# EAGLE design Arduino_R3_Half_Template (EAGLE 7.2.0)
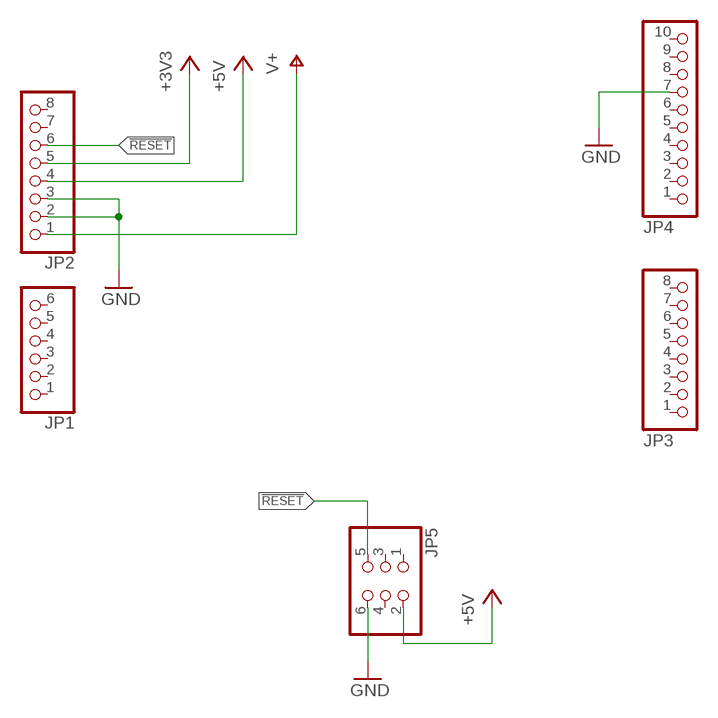
[diagram p0: schematic, sheet 1]

## Parts
JP1  PINHD-1X6  [1X06]
JP2  PINHD-1X8  [1X08]
JP3  PINHD-1X8  [1X08]
JP4  PINHD-1X10  [1X10]
JP5  PINHD-2X3  [2X03]

## Nets
!RESET: JP2.6 JP5.5
+3V3: JP2.5
+5V [usbvcc]: JP2.4 JP5.2
GND [ground]: JP2.2 JP2.3 JP4.7 JP5.6
V+ [power]: JP2.1
Unconnected: JP1.1 JP1.2 JP1.3 JP1.4 JP1.5 JP1.6 JP2.7 JP2.8 JP3.1 JP3.2 JP3.3 JP3.4 JP3.5 JP3.6 JP3.7 JP3.8 JP4.1 JP4.2 JP4.3 JP4.4 JP4.5 JP4.6 JP4.8 JP4.9 JP4.10 JP5.1 JP5.3 JP5.4

## Library data of the parts
JP1 = Arduino_R3_Half_Template:PINHD-1X6: PIN HEADER
JP2 JP3 = Arduino_R3_Half_Template:PINHD-1X8: PIN HEADER
JP4 = Arduino_R3_Half_Template:PINHD-1X10: PIN HEADER
JP5 = Arduino_R3_Half_Template:PINHD-2X3: PIN HEADER

## Net classes
0 default: width 0.254 mm, clearance 0.254 mm
1 power: width 0.61 mm, drill 0.61 mm, clearance 0.254 mm
2 ground: width 0.305 mm, drill 0.559 mm, clearance 0.254 mm
3 usbvcc: width 0.508 mm, drill 0.61 mm, clearance 0.254 mm
4 aref: width 0.406 mm, drill 0.61 mm, clearance 0.254 mm

## Board
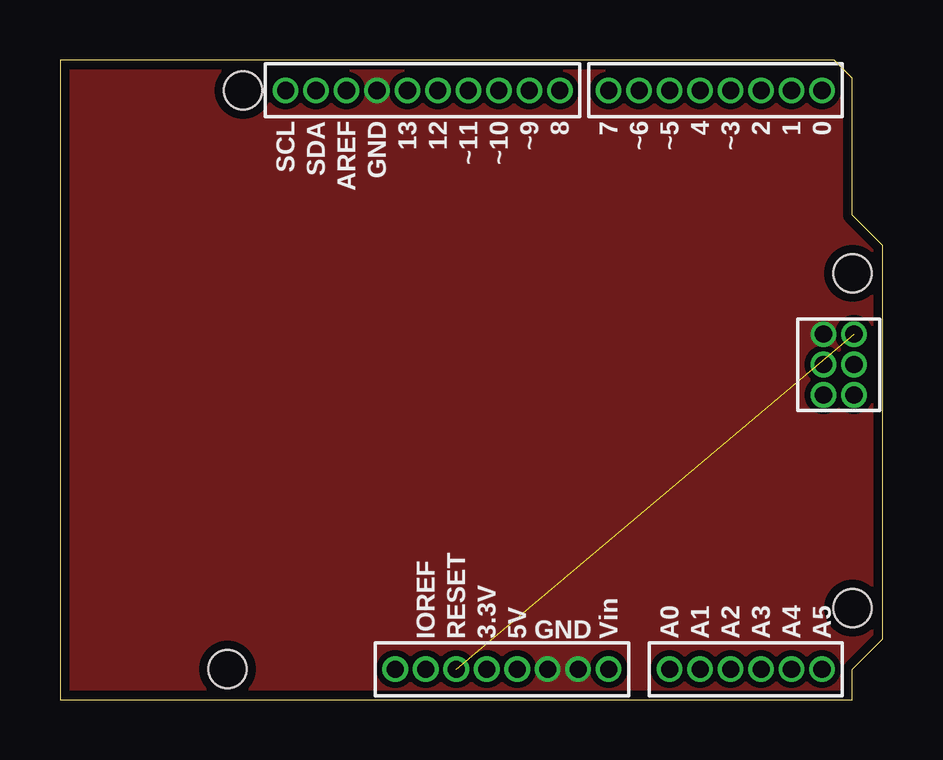
[diagram p1: board, top side]
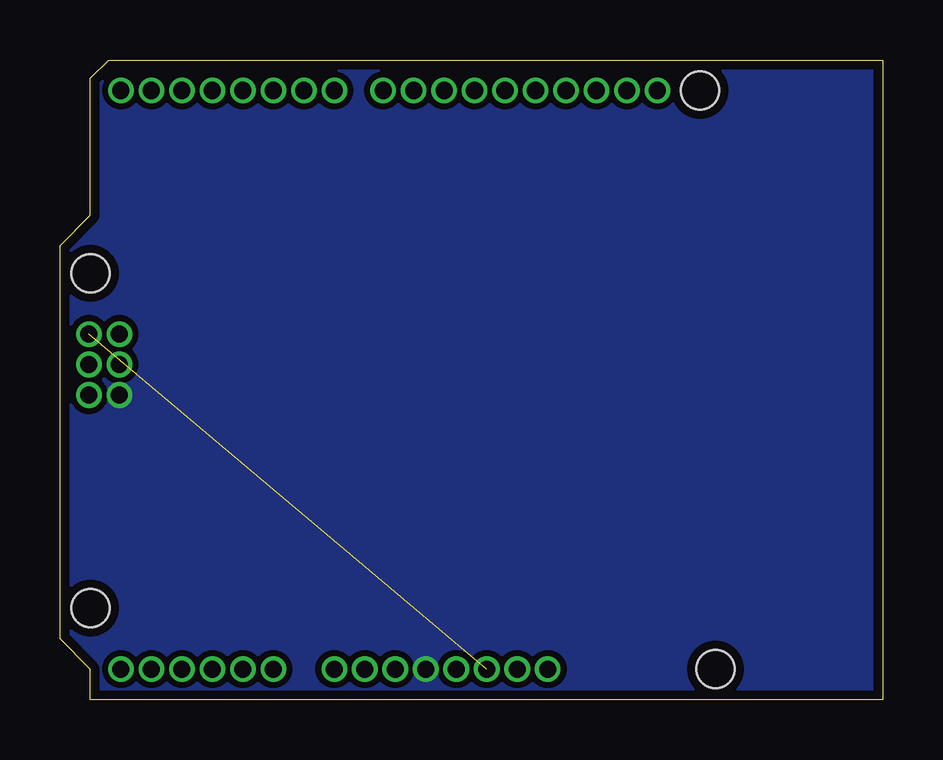
[diagram p2: board, bottom side, seen from below]

Size 34.29 x 26.67 mm. Coordinates in mm from the lower left corner, seen from the top.
Outline: 0,0 33.02,0 33.02,1.27 34.29,2.54 34.29,18.92 33.02,20.19 33.02,25.91 32.26,26.67 0,26.67 0,0
Copper layers (1*16): Top 0.0356mm / dielectric 1.5011mm / Bottom 0.0356mm
Design rules "oshpark-2layer": minimum track width 6mil, minimum drill 13mil, track to track 6mil, track to pad 6mil, pad to pad 6mil, via to via 6mil, smd to smd 6mil, copper to edge 15mil, drill to drill 6mil, minimum pad ring 7mil, minimum via ring 7mil, stop-mask expansion 4mil, vias tented up to drill 0mil, thermal gap 10mil
Holes 1.59 mm at 6.99,1.27 7.62,25.4 33.02,17.78 33.02,3.81

### Footprints (pad centres in the part's own frame; a part is rotated, then mirrored left to right if it is on the bottom)
1X06 = drill 0.711 pad 1.016: 1 -3.175,0; 2 -1.905,0; 3 -0.635,0; 4 0.635,0; 5 1.905,0; 6 3.175,0
1X08 = drill 0.711 pad 1.016: 1 -4.445,0; 2 -3.175,0; 3 -1.905,0; 4 -0.635,0; 5 0.635,0; 6 1.905,0; 7 3.175,0; 8 4.445,0
1X10 = drill 0.711 pad 1.016: 1 -5.715,0; 2 -4.445,0; 3 -3.175,0; 4 -1.905,0; 5 -0.635,0; 6 0.635,0; 7 1.905,0; 8 3.175,0; 9 4.445,0; 10 5.715,0
2X03 = drill 0.711 pad 1.016: 1 -1.27,-0.635; 2 -1.27,0.635; 3 0,-0.635; 4 0,0.635; 5 1.27,-0.635; 6 1.27,0.635

### Placement (x,y rotation side)
JP1  28.57,1.27 180 top
JP2  18.41,1.27 180 top
JP3  27.3,25.4 180 top
JP4  15.11,25.4 180 top
JP5  32.45,13.97 90 top

### Tracks (layer width: path | path; a pad name or v marks a point on that pad's centre or on a via)
!RESET  (1 unrouted)
+5V
  pour Bottom (no thermals): 0,0 33.02,0 33.02,1.27 34.29,2.54 34.29,18.92 33.02,20.19 33.02,25.91 32.26,26.67 0,26.67
GND
  pour Top (no thermals): 0,0 33.02,0 33.02,1.27 34.29,2.54 34.29,18.92 33.02,20.19 33.02,25.91 32.26,26.67 0,26.67

### Text on the board
tPlace: SCL | SDA | AREF | GND | 13 | 12 | ~11 | ~10 | ~9 | 8 | 7 | ~6 | ~5 | 4 | ~3 | 2 | 1 | 0 | IOREF | RESET | 3.3V | 5V | GND | Vin | A0 | A1 | A2 | A3 | A4 | A5